# Altium project TeachEE.PrjPcb (part 1 of 2)
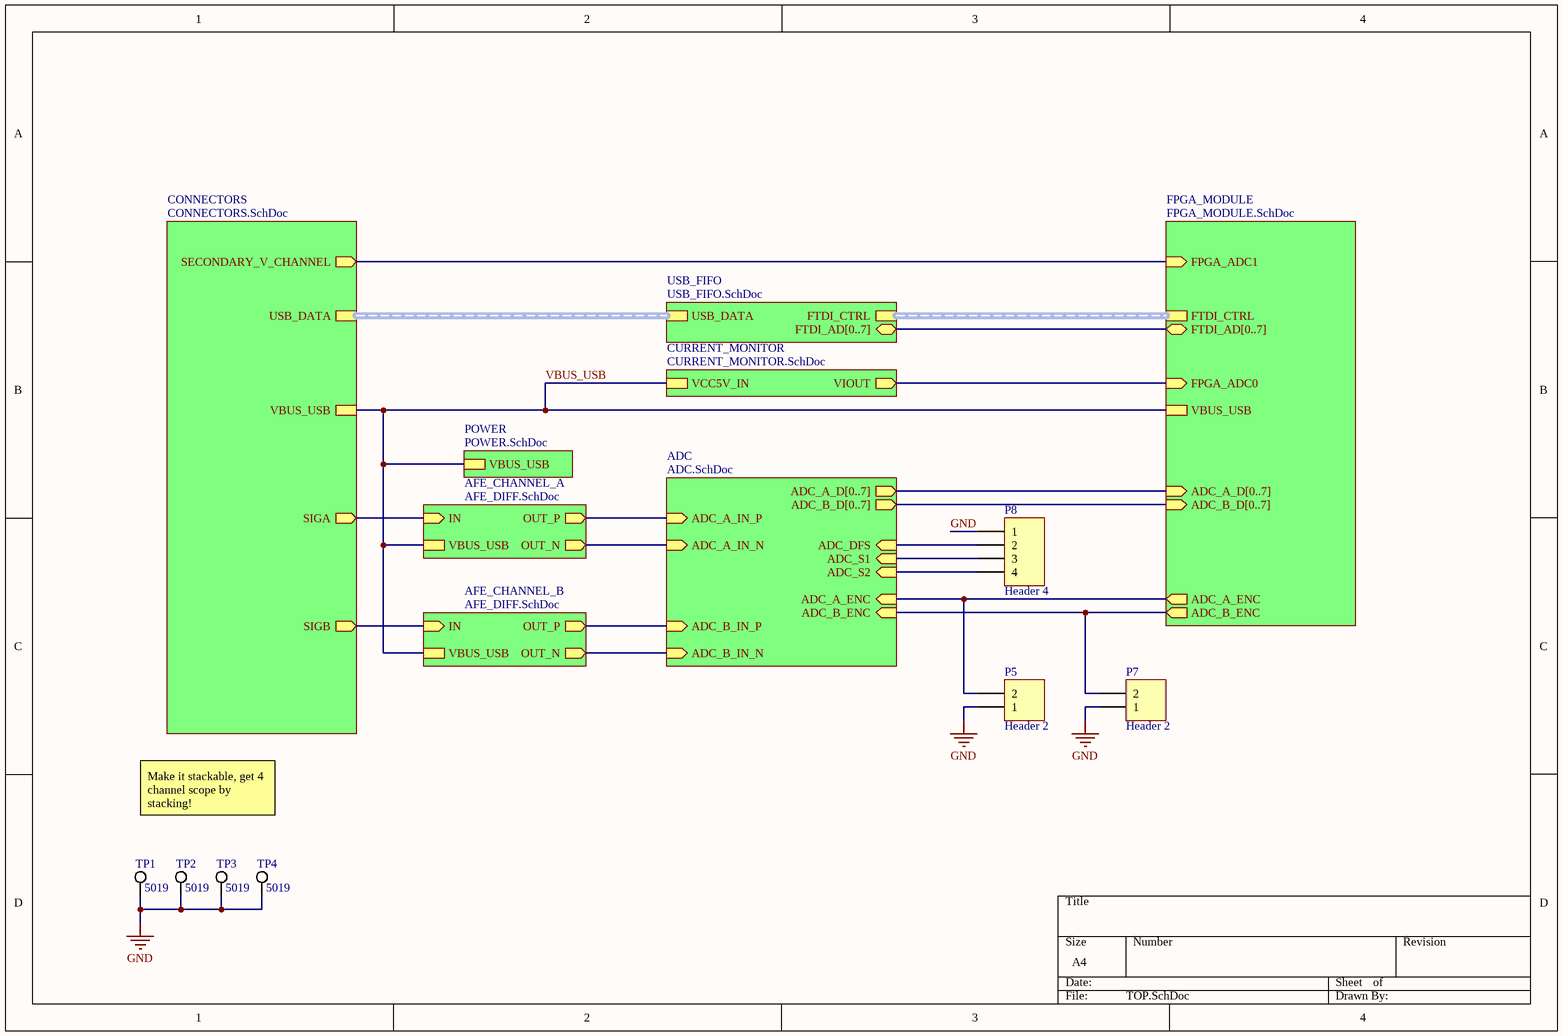
[diagram p0: TOP.SchDoc]
8 sheets, 192 parts. Net scope: hierarchical (ports join the sheet entries above them; power ports are global).
Board file: PCB.PcbDoc
Sheets:
  TOP.SchDoc
    USB_FIFO = USB_FIFO.SchDoc
    FPGA_MODULE = FPGA_MODULE.SchDoc
    CONNECTORS = CONNECTORS.SchDoc
    ADC = ADC.SchDoc
    POWER = POWER.SchDoc
    AFE_CHANNEL_A = AFE_DIFF.SchDoc
    CURRENT_MONITOR = CURRENT_MONITOR.SchDoc
    AFE_CHANNEL_B = AFE_DIFF.SchDoc

## Sheet TOP.SchDoc
size A4; SheetNumber: 1; SheetTotal: 9

### Parts
P5  Header 2  [HDR1X2]
P7  Header 2  [HDR1X2]
P8  Header 4  [HDR1X4]
TP1  5019  [KSTN-5019_V]
TP2  5019  [KSTN-5019_V]
TP3  5019  [KSTN-5019_V]
TP4  5019  [KSTN-5019_V]

### Sub-sheets
ADC = ADC.SchDoc: ADC_A_IN_P (in), ADC_A_D[0..7] (out), ADC_A_ENC (in), ADC_B_IN_P (in), ADC_B_ENC (in), ADC_DFS (in), ADC_S1 (in), ADC_S2 (in), ADC_B_D[0..7] (out), ADC_A_IN_N (in), ADC_B_IN_N (in)
AFE_CHANNEL_A = AFE_DIFF.SchDoc: IN (in), OUT_P (out), OUT_N (out), VBUS_USB
AFE_CHANNEL_B = AFE_DIFF.SchDoc: IN (in), OUT_P (out), OUT_N (out), VBUS_USB
CONNECTORS = CONNECTORS.SchDoc: USB_DATA (harness USB_DATA), VBUS_USB, SIGA (out), SECONDARY_V_CHANNEL (out), SIGB (out)
CURRENT_MONITOR = CURRENT_MONITOR.SchDoc: VIOUT (out), VCC5V_IN
FPGA_MODULE = FPGA_MODULE.SchDoc: FTDI_CTRL (harness FTDI_CTRL), FTDI_AD[0..7] (bidir), VBUS_USB, ADC_A_D[0..7] (in), ADC_A_ENC (out), FPGA_ADC0 (in), FPGA_ADC1 (in), ADC_B_ENC (out), ADC_B_D[0..7] (in)
POWER = POWER.SchDoc: VBUS_USB
USB_FIFO = USB_FIFO.SchDoc: USB_DATA (harness USB_DATA), FTDI_CTRL (harness FTDI_CTRL), FTDI_AD[0..7] (bidir)

### Nets
GND: P5.1 P7.1 P8.1 TP1.1 TP2.1 TP3.1 TP4.1
ADC_A_ENC: P5.2 ; sheet FPGA_MODULE/ADC_A_ENC, sheet ADC/ADC_A_ENC
ADC_A_IN_N: sheet ADC/ADC_A_IN_N, sheet AFE_CHANNEL_A/OUT_N
ADC_A_IN_P: sheet ADC/ADC_A_IN_P, sheet AFE_CHANNEL_A/OUT_P
ADC_B_ENC: P7.2 ; sheet FPGA_MODULE/ADC_B_ENC, sheet ADC/ADC_B_ENC
ADC_B_IN_N: sheet ADC/ADC_B_IN_N, sheet AFE_CHANNEL_B/OUT_N
ADC_B_IN_P: sheet ADC/ADC_B_IN_P, sheet AFE_CHANNEL_B/OUT_P
ADC_DFS: P8.2 ; sheet ADC/ADC_DFS
ADC_S1: P8.3 ; sheet ADC/ADC_S1
ADC_S2: P8.4 ; sheet ADC/ADC_S2
FPGA_ADC0: sheet FPGA_MODULE/FPGA_ADC0, sheet CURRENT_MONITOR/VIOUT
FPGA_ADC1: sheet FPGA_MODULE/FPGA_ADC1, sheet CONNECTORS/SECONDARY_V_CHANNEL
SIGA: sheet CONNECTORS/SIGA, sheet AFE_CHANNEL_A/IN
SIGB: sheet CONNECTORS/SIGB, sheet AFE_CHANNEL_B/IN
VBUS_USB: sheet FPGA_MODULE/VBUS_USB, sheet CONNECTORS/VBUS_USB, sheet POWER/VBUS_USB, sheet AFE_CHANNEL_A/VBUS_USB, sheet CURRENT_MONITOR/VCC5V_IN, sheet AFE_CHANNEL_B/VBUS_USB

### Buses and harness runs
bus sheet ADC/ADC_A_D[0..7] = sheet FPGA_MODULE/ADC_A_D[0..7]
bus sheet ADC/ADC_B_D[0..7] = sheet FPGA_MODULE/ADC_B_D[0..7]
bus sheet FPGA_MODULE/FTDI_AD[0..7] = sheet USB_FIFO/FTDI_AD[0..7]
harness sheet CONNECTORS/USB_DATA = sheet USB_FIFO/USB_DATA
harness sheet FPGA_MODULE/FTDI_CTRL = sheet USB_FIFO/FTDI_CTRL

### Notes on the sheet
- Make it stackable, get 4 channel scope by stacking!

### Library data of the parts
P5 P7 = Header 2: Header, 2-Pin; LatestRevisionDate: 17-Jul-2002; LatestRevisionNote: Re-released for DXP Platform.; Publisher: Altium Limited
P8 = Header 4: Header, 4-Pin; LatestRevisionDate: 17-Jul-2002; LatestRevisionNote: Re-released for DXP Platform.; Publisher: Altium Limited
TP1-TP4 = CMP-1672-00008-1: Test Point, 1 Position SMD, RoHS, Tape and Reel; ComponentLink1Description: Manufacturer URL; Package Quantity: 1000; DatasheetVersion: 03/2014; Packaging: Tape and Reel; ComponentLink2URL: http://www.keyelco.com/product-pdf.cfm?p=1357; ComponentLink1URL: http://www.keyelco.com/; Mount: Surface Mount; Contact Plating: Silver; PackageDescription: 1-Pin Surface Mount Device, Body 3.81 x 2.03 mm; Pins: 1; RoHSCompliant: True; Mounting Technology: Surface Mount; ComponentLink2Description: Datasheet; PackageReference: 5019

## Sheet USB_FIFO.SchDoc
size A4; SheetNumber: 3; SheetTotal: 8
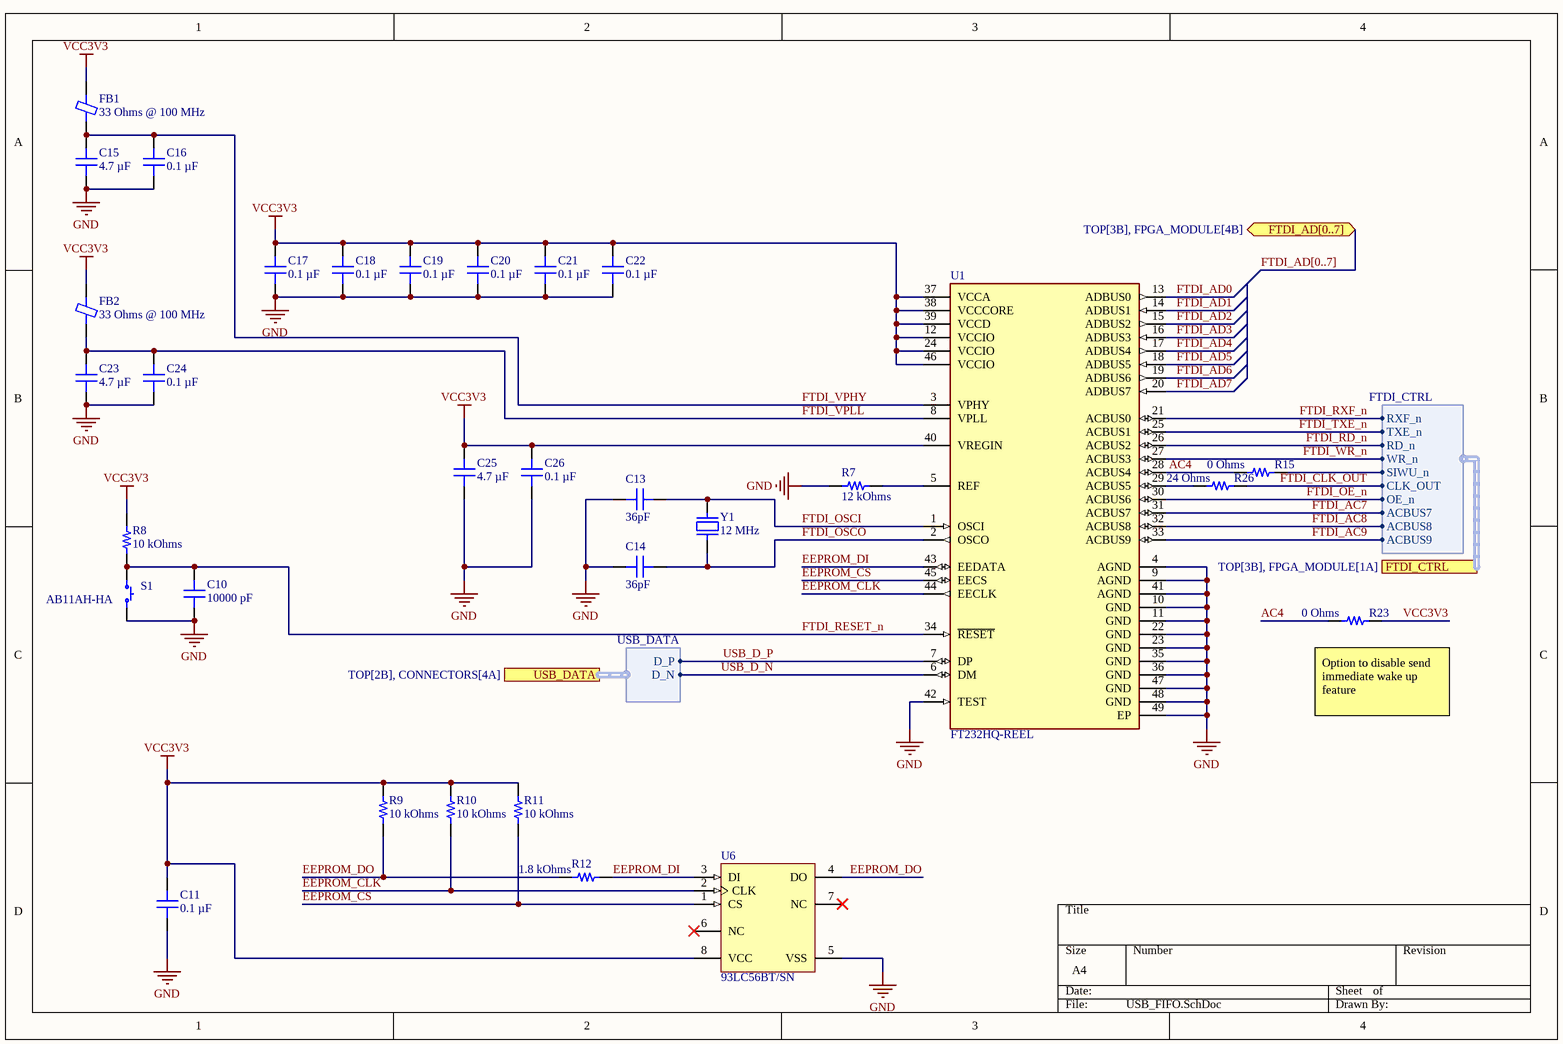
[diagram p1: USB_FIFO.SchDoc]

### Parts
C10  10000 pF  [CAP 0402_1005]
C11  0.1 µF  [CAP 0402_1005]
C13  36pF  [CAP 0603_1608]
C14  36pF  [CAP 0603_1608]
C15  4.7 µF  [CAP 0402_1005]
C16  0.1 µF  [CAP 0402_1005]
C17  0.1 µF  [CAP 0402_1005]
C18  0.1 µF  [CAP 0402_1005]
C19  0.1 µF  [CAP 0402_1005]
C20  0.1 µF  [CAP 0402_1005]
C21  0.1 µF  [CAP 0402_1005]
C22  0.1 µF  [CAP 0402_1005]
C23  4.7 µF  [CAP 0402_1005]
C24  0.1 µF  [CAP 0402_1005]
C25  4.7 µF  [CAP 0402_1005]
C26  0.1 µF  [CAP 0402_1005]
FB1  33 Ohms @ 100 MHz  [FER 0201_0603]
FB2  33 Ohms @ 100 MHz  [FER 0201_0603]
R7  12 kOhms  [RES 0402_1005]
R8  10 kOhms  [RES 0402_1005]
R9  10 kOhms  [RES 0402_1005]
R10  10 kOhms  [RES 0402_1005]
R11  10 kOhms  [RES 0402_1005]
R12  1.8 kOhms  [RES 0402_1005]
R15  0 Ohms  [RES 0603_1608]
R23  0 Ohms  [RES 0603_1608]
R26  24 Ohms  [RES 0402_1005]
S1  AB11AH-HA  [NKK AB11AH-HA]
U1  FT232HQ-REEL  [FP-QFN-48-MFG]
U6  93LC56BT/SN  [SOIC-SN8_M]
Y1  12 MHz  [ABRACON ABLS]

### Ports
FTDI_AD[0..7] (bidir, see TOP[3B], FPGA_MODULE[4B]), FTDI_CTRL (harness FTDI_CTRL, see TOP[3B], FPGA_MODULE[1A]), USB_DATA (harness USB_DATA, see TOP[2B], CONNECTORS[4A])

### Harnesses
USB_DATA: D_N, D_P
FTDI_CTRL: RXF_n, TXE_n, RD_n, WR_n, CLK_OUT, OE_n, ACBUS7, ACBUS8, ACBUS9, SIWU_n

### Nets
GND: C10.1 C11.1 C13.1 C14.1 C15.1 C16.1 C17.1 C18.1 C19.1 C20.1 C21.1 C22.1 C23.1 C24.1 C25.1 C26.1 R7.1 S1.1 U1.4(AGND) U1.9(AGND) U1.10(GND) U1.11(GND) U1.22(GND) U1.23(GND) U1.35(GND) U1.36(GND) U1.41(AGND) U1.42(TEST) U1.47(GND) U1.48(GND) U1.49(EP) U6.5(VSS)
VCC3V3: C11.2 C17.2 C18.2 C19.2 C20.2 C21.2 C22.2 C25.2 C26.2 FB1.2 FB2.2 R8.2 R9.2 R10.2 R11.2 R23.2 U1.12(VCCIO) U1.24(VCCIO) U1.37(VCCA) U1.38(VCCCORE) U1.39(VCCD) U1.40(VREGIN) U1.46(VCCIO) U6.8(VCC)
AC4: R15.1 R23.1 U1.28(ACBUS4)
EEPROM_CLK: R10.1 U1.44(EECLK) U6.2(CLK)
EEPROM_CS: R11.1 U1.45(EECS) U6.1(CS)
EEPROM_DI: R12.2 U1.43(EEDATA) U6.3(DI)
EEPROM_DO: R9.1 R12.1 U6.4(DO)
FTDI_AC7: U1.31(ACBUS7) ; port FTDI_CTRL.ACBUS7
FTDI_AC8: U1.32(ACBUS8) ; port FTDI_CTRL.ACBUS8
FTDI_AC9: U1.33(ACBUS9) ; port FTDI_CTRL.ACBUS9
FTDI_AD0: U1.13(ADBUS0)
FTDI_AD1: U1.14(ADBUS1)
FTDI_AD2: U1.15(ADBUS2)
FTDI_AD3: U1.16(ADBUS3)
FTDI_AD4: U1.17(ADBUS4)
FTDI_AD5: U1.18(ADBUS5)
FTDI_AD6: U1.19(ADBUS6)
FTDI_AD7: U1.20(ADBUS7)
FTDI_CLK_OUT: R26.2 ; port FTDI_CTRL.CLK_OUT
FTDI_OE_n: U1.30(ACBUS6) ; port FTDI_CTRL.OE_n
FTDI_OSCI: C13.2 U1.1(OSCI) Y1.2
FTDI_OSCO: C14.2 U1.2(OSCO) Y1.1
FTDI_RD_n: U1.26(ACBUS2) ; port FTDI_CTRL.RD_n
FTDI_RESET_n: C10.2 R8.1 S1.3 U1.34(~{RESET})
FTDI_RXF_n: U1.21(ACBUS0) ; port FTDI_CTRL.RXF_n
FTDI_TXE_n: U1.25(ACBUS1) ; port FTDI_CTRL.TXE_n
FTDI_VPHY: C15.2 C16.2 FB1.1 U1.3(VPHY)
FTDI_VPLL: C23.2 C24.2 FB2.1 U1.8(VPLL)
FTDI_WR_n: U1.27(ACBUS3) ; port FTDI_CTRL.WR_n
SIWU_n: R15.2 ; port FTDI_CTRL.SIWU_n
USB_D_N: U1.6(DM) ; port USB_DATA.D_N
USB_D_P: U1.7(DP) ; port USB_DATA.D_P
NetR7_2: R7.2 U1.5(REF)
NetR26_1: R26.1 U1.29(ACBUS5)

Not connected (* = marked no-connect by the designer): U6 6(NC)* 7(NC)*

### Buses and harness runs
bus FTDI_AD[0..7] = port FTDI_AD[0..7]

### Notes on the sheet
- (near R23) Option to disable send immediate wake up feature

### Library data of the parts
C10 = HMK105B7103KVHFE: CAP MLCC 0.01UF 100V X7R 0402; manufacturer: Taiyo Yuden; Tolerance: ±10%; Part Number: HMK105B7103KVHFE; Value: 10000 pF; Applications: Automotive, SMPS Filtering; Capacitance: 10000 pF; componentlink1description: Datasheet; componentlink1url: https://ds.yuden.co.jp/TYCOMPAS/ut/detail?pn=HMK105B7103KVHFE&u=M; componentlink2description: DigiKey Link; componentlink2url: https://www.digikey.com/en/products/detail/taiyo-yuden/HMK105B7103KVHFE/11687483; Device Package: 0402 (1005 Metric); lastupdated: 2022-07-15 11:24:57 AM; Lifecycle Status: Active; Minimum Order: 1; Mounting Type: Surface Mount, MLCC; Operating Temperature: -55°C ~ 125°C; Package / Case: 0402 (1005 Metric); packaging: TapeAndReel; partid: 41784; Part Status: Active; price: 0.02; Ratings: AEC-Q200; series: M; Size / Dimension: 0.039" L x 0.020" W (1.00mm x 0.50mm); Supplier 1: DigiKey; Supplier Part Number 1: 587-HMK105B7103KVHFECT-ND; Temperature Coefficient: X7R; Thickness (Max): 0.022" (0.55mm); Voltage - Rated: 100V
C11 C16-C22 C24 C26 = CGA2B3X5R1H104M050BB: CAP CER 0.1UF 50V X5R 0402; manufacturer: TDK Corporation; Tolerance: ±20%; Part Number: CGA2B3X5R1H104M050BB; Value: 0.1 µF; Applications: Automotive; Capacitance: 0.1 µF; componentlink1description: Datasheet; componentlink1url: https://product.tdk.com/info/en/catalog/datasheets/mlcc_automotive_general_en.pdf?ref_disty=digikey; componentlink2description: DigiKey Link; componentlink2url: https://www.digikey.com/en/products/detail/tdk-corporation/CGA2B3X5R1H104M050BB/3949450; Device Package: 0402 (1005 Metric); Lifecycle Status: Active; Minimum Order: 1; Mounting Type: Surface Mount, MLCC; Operating Temperature: -55°C ~ 85°C; Package / Case: 0402 (1005 Metric); packaging: TapeAndReel; partid: 1792; Part Status: Active; price: 0.02; Ratings: AEC-Q200; series: CGA; Size / Dimension: 0.039" L x 0.020" W (1.00mm x 0.50mm); Supplier 1: DigiKey; Supplier Part Number 1: 445-12214-1-ND; Temperature Coefficient: X5R; Thickness (Max): 0.022" (0.55mm); Voltage - Rated: 50V
  C11: lastupdated: 2022-07-15 11:25:55 AM
  C16-C22 C24 C26: lastupdated: 2022-07-21 3:55:54 AM
C13 C14 = 06031A360JAT2A: CAP CER 36PF 100V NP0 0603; manufacturer: AVX Corporation; Temperature Coefficient: C0G, NP0; Tolerance: ±5%; Part Number: 06031A360JAT2A; Value: 36pF; Applications: General Purpose; Capacitance: 36pF; componentlink1description: Datasheet; componentlink1url: http://datasheets.avx.com/C0GNP0-Dielectric.pdf; componentlink2description: DigiKey Link; componentlink2url: http://digikey.com/product-detail/en/avx-corporation/06031A360JAT2A/478-10202-1-ND/6797206; Device Package: 0603 (1608 Metric); lastupdated: 2020-09-02 1:03:27 AM; Lifecycle Status: Active; Minimum Order: 1; Mounting Type: Surface Mount, MLCC; Operating Temperature: -55°C ~ 125°C; Package / Case: 0603 (1608 Metric); packaging: TapeAndReel; partid: 7331; Part Status: Active; price: 0.04; series: -; Size / Dimension: 0.063" L x 0.032" W (1.60mm x 0.81mm); Supplier 1: DigiKey; Supplier Part Number 1: 478-10202-1-ND; Thickness (Max): 0.035" (0.90mm); Voltage - Rated: 100V
C15 C23 C25 = CL05A475MO5NUNC: CAP CER 4.7UF 16V X5R 0402; manufacturer: Samsung Electro-Mechanics; Tolerance: ±20%; Part Number: CL05A475MO5NUNC; Value: 4.7 µF; Applications: General Purpose; Capacitance: 4.7 µF; componentlink1description: Datasheet; componentlink1url: http://www.samsungsem.com/kr/support/product-search/mlcc/__icsFiles/afieldfile/2019/05/29/Data%20sheet_CL05A475MO5NUNC.pdf; componentlink2description: DigiKey Link; componentlink2url: https://www.digikey.com/en/products/detail/samsung-electro-mechanics/CL05A475MO5NUNC/5961320; Device Package: 0402 (1005 Metric); lastupdated: 2022-07-21 3:55:55 AM; Lifecycle Status: Active; Minimum Order: 1; Mounting Type: Surface Mount, MLCC; Operating Temperature: -55°C ~ 85°C; Package / Case: 0402 (1005 Metric); packaging: TapeAndReel; partid: 1760; Part Status: Active; price: 0.09; series: CL; Size / Dimension: 0.039" L x 0.020" W (1.00mm x 0.50mm); Supplier 1: DigiKey; Supplier Part Number 1: 1276-6836-1-ND; Temperature Coefficient: X5R; Thickness (Max): 0.028" (0.70mm); Voltage - Rated: 16V
FB1 FB2 = MMZ0603F330CT000: FERRITE BEAD 33 OHM 0201 1LN; Manufacturer: TDK Corporation; Current Rating (Max): 150mA; DC Resistance (DCR) (Max): 1.3Ohm; Filter Type: Signal Line; Number of Lines: 1; Part Number: MMZ0603F330CT000; ComponentLink1Description: Datasheet; ComponentLink1URL: https://product.tdk.com/info/en/catalog/datasheets/beads_commercial_signal_mmz0603_en.pdf?ref_disty=digikey; ComponentLink2Description: DigiKey Link; ComponentLink2URL: https://www.digikey.com/en/products/detail/tdk-corporation/MMZ0603F330CT000/2747662; Device Package: 0201 (0603 Metric); Height (Max): 0.013" (0.33mm); Impedance @ Frequency: 33 Ohms @ 100 MHz; LastUpdated: 2022-07-21 4:37:41 AM; Lifecycle Status: Active; Minimum Order: 1; Mounting Type: Surface Mount; Operating Temperature: -55°C ~ 125°C; Package / Case: 0201 (0603 Metric); Packaging: TapeAndReel; PartId: 1; Part Status: Active; Price: 0.03; Series: MMZ; Size / Dimension: 0.024" L x 0.012" W (0.60mm x 0.30mm); Supplier 1: DigiKey; Supplier Part Number 1: 445-7792-1-ND; Value: 33 Ohms @ 100 MHz
R7 = CPF0402B12KE1: RES SMD 12K OHM 0.1% 1/16W 0402; Manufacturer: TE Connectivity Passive Product; Power (Watts): 0.063W, 1/16W; Temperature Coefficient: ±25ppm/°C; Part Number: CPF0402B12KE1; Value: 12 kOhms; ComponentLink1Description: Datasheet; ComponentLink1URL: https://www.te.com/commerce/DocumentDelivery/DDEController?Action=srchrtrv&DocNm=1773200&DocType=DS&DocLang=English; ComponentLink2Description: DigiKey Link; ComponentLink2URL: https://www.digikey.com/en/products/detail/te-connectivity-passive-product/CPF0402B12KE1/2381830; Composition: Thin Film; Device Package: 0402 (1005 Metric); Height - Seated (Max): 0.014" (0.35mm); LastUpdated: 2022-07-15 11:43:11 AM; Lifecycle Status: Active; Minimum Order: 1; Number of Terminations: 2; Operating Temperature: -55°C ~ 155°C; Package / Case: 0402 (1005 Metric); Packaging: TapeAndReel; PartId: 3318; Part Status: Active; Price: 0.15; Resistance: 12 kOhms; Series: CPF, Neohm; Size / Dimension: 0.039" L x 0.020" W (1.00mm x 0.50mm); Supplier 1: DigiKey; Supplier Part Number 1: A102603CT-ND; Supplier Device Package: 0402; Tolerance: ±0.1%
R8-R11 = RP73PF1E10KBTD: RES 10K OHM 0.1% 1/10W 0402; Manufacturer: TE Connectivity Passive Product; Power (Watts): 0.1W, 1/10W; Temperature Coefficient: ±25ppm/°C; Part Number: RP73PF1E10KBTD; Value: 10 kOhms; ComponentLink1Description: Datasheet; ComponentLink1URL: https://www.te.com/commerce/DocumentDelivery/DDEController?Action=srchrtrv&DocNm=1773272&DocType=DS&DocLang=English; ComponentLink2Description: DigiKey Link; ComponentLink2URL: https://www.digikey.com/en/products/detail/te-connectivity-passive-product/RP73PF1E10KBTD/8260957; Composition: Thin Film; Device Package: 0402 (1005 Metric); Height - Seated (Max): 0.014" (0.35mm); LastUpdated: 2022-07-15 11:43:14 AM; Lifecycle Status: Active; Minimum Order: 1; Number of Terminations: 2; Operating Temperature: -55°C ~ 155°C; Package / Case: 0402 (1005 Metric); Packaging: TapeAndReel; PartId: 2434; Part Status: Active; Price: 0.09; Resistance: 10 kOhms; Series: RP73, Holsworthy; Size / Dimension: 0.039" L x 0.020" W (1.00mm x 0.50mm); Supplier 1: DigiKey; Supplier Part Number 1: A127415CT-ND; Supplier Device Package: 0402; Tolerance: ±0.1%
R12 = RC0402FR-071K8L: RES 1.8K OHM 1% 1/16W 0402; Manufacturer: Yageo; Power (Watts): 0.063W, 1/16W; Temperature Coefficient: ±100ppm/°C; Part Number: RC0402FR-071K8L; Value: 1.8 kOhms; ComponentLink1Description: Datasheet; ComponentLink1URL: https://www.yageo.com/upload/media/product/productsearch/datasheet/rchip/PYu-RC_Group_51_RoHS_L_10.pdf; ComponentLink2Description: DigiKey Link; ComponentLink2URL: https://www.digikey.com/en/products/detail/yageo/RC0402FR-071K8L/726520; Composition: Thick Film; Device Package: 0402 (1005 Metric); Features: Moisture Resistant; Height - Seated (Max): 0.016" (0.40mm); LastUpdated: 2022-07-21 4:11:16 AM; Lifecycle Status: Active; Minimum Order: 1; Number of Terminations: 2; Operating Temperature: -55°C ~ 155°C; Package / Case: 0402 (1005 Metric); Packaging: CutTape; PartId: 2542; Part Status: Active; Price: 0.01; Resistance: 1.8 kOhms; Series: RC_L; Size / Dimension: 0.039" L x 0.020" W (1.00mm x 0.50mm); Supplier 1: DigiKey; Supplier Part Number 1: 311-1.80KLRCT-ND; Supplier Device Package: 0402; Tolerance: ±1%
R15 R23 = 5110: RES SMD 0 OHM JUMPER 1/2W 0603; Part Number: 5110; Manufacturer: Keystone Electronics; Power (Watts): 0.5W, 1/2W; Value: 0 Ohms; ComponentLink1Description: Datasheet; ComponentLink1URL: http://keyelco.com/userAssets/file/M65p54.pdf; ComponentLink2Description: DigiKey Link; ComponentLink2URL: https://www.digikey.com/en/products/detail/keystone-electronics/5110/5118870; Composition: Metal Element; Device Package: 0603 (1608 Metric); Height - Seated (Max): 0.028" (0.70mm); LastUpdated: 2022-09-14 8:08:57 AM; Lifecycle Status: Active; Minimum Order: 1; Number of Terminations: 2; Package / Case: 0603 (1608 Metric); Packaging: TapeAndReel; PartId: 20779; Part Status: Active; Price: 0.16; Resistance: 0 Ohms; Series: -; Size / Dimension: 0.061" L x 0.033" W (1.55mm x 0.85mm); Supplier 1: DigiKey; Supplier Part Number 1: 36-5110CT-ND; Supplier Device Package: 0603; Tolerance: Jumper
R26 = RC0402FR-0724RL: RES 24 OHM 1% 1/16W 0402; Manufacturer: Yageo; Power (Watts): 0.063W, 1/16W; Temperature Coefficient: ±100ppm/°C; Part Number: RC0402FR-0724RL; Value: 24 Ohms; ComponentLink1Description: Datasheet; ComponentLink1URL: https://www.yageo.com/upload/media/product/productsearch/datasheet/rchip/PYu-RC_Group_51_RoHS_L_10.pdf; ComponentLink2Description: DigiKey Link; ComponentLink2URL: https://www.digikey.com/en/products/detail/yageo/RC0402FR-0724RL/5280933; Composition: Thick Film; Device Package: 0402 (1005 Metric); Features: Moisture Resistant; Height - Seated (Max): 0.016" (0.40mm); LastUpdated: 2022-09-19 1:15:03 PM; Lifecycle Status: Active; Minimum Order: 1; Number of Terminations: 2; Operating Temperature: -55°C ~ 155°C; Package / Case: 0402 (1005 Metric); Packaging: CutTape; PartId: 2811; Part Status: Active; Price: 0.01; Resistance: 24 Ohms; Series: RC_L; Size / Dimension: 0.039" L x 0.020" W (1.00mm x 0.50mm); Supplier 1: DigiKey; Supplier Part Number 1: YAG3073CT-ND; Supplier Device Package: 0402; Tolerance: ±1%
S1 = AB11AH-HA: SWITCH PUSH SPST-NO 0.4VA 28V; Manufacturer: NKK Switches; Actuator Type: Round, Button; Color - Actuator/Cap: Black; Current Rating (Amps): 0.4VA (AC/DC); Switch Function: Off-Mom; Part Number: AB11AH-HA; Circuit: SPST-NO; ComponentLink1Description: Datasheet; ComponentLink1URL: https://www.nkkswitches.com/pdf/Apushbuttons.pdf; ComponentLink2Description: DigiKey Link; ComponentLink2URL: //digikey.com/product-detail/en/nkk-switches/AB11AH-HA/360-2703-ND/1056050; Features: Sealed - Fully; LastUpdated: 2019-12-12 8:13:11 AM; Lifecycle Status: 0; Minimum Order: 1; Mounting Type: Through Hole, Right Angle; Operating Temperature: -30°C ~ 85°C; Packaging: Tray; Part Status: Active; Price: 5.00; Series: AB; Supplier 1: DigiKey; Supplier Part Number 1: 360-2703-ND; Termination Style: PC Pin; Type: Standard; Voltage Rating - AC: 28V; Voltage Rating - DC: 28V
U1 = CMP-0078-00034-4: IC HS USB TO UART/FIFO 48QFN; Number of Channels: 1; Max Supply Voltage: 3.63V; Min Supply Voltage: 2.97V; Operating Supply Current: 24mA; Data Rate: 12Mbps; Interface: UART; Nominal Supply Current: 60mA; Operating Supply Voltage: 3.3V; Case/Package: QFN; Packaging: Tape and Reel; Weight: 0.005309oz; Number of Pins: 48; REACH SVHC: No SVHC; Length: 7mm; Mount: Surface Mount; Package Quantity: 1; Lead Free: Lead Free; Radiation Hardening: No; Max Operating Temperature: 85°C; Min Operating Temperature: -40°C; Height: 1.4mm; Width: 7mm
U6 = CMP-0162-00132-1: 2K, 128x16-bit, 2.5V Microwire Serial EEPROM, 8-Pin SOIC 150mil, Commercial Temperature, Tape and Reel; ComponentAvailability: Unknown. Contact manufacturer to determine status.; Code_IPC: SOIC127P600-8; PackageReference: SOIC-SN8; Code_JEDEC: MS-012; DatasheetVersion: revF, May-2008; PackageDescription: 8-Lead Plastic Small Outline (SN) - Narrow, 3.90mm Body [SOIC]; PackageVersion: revBB, Aug-2009
Y1 = ABLS-12.000MHZ-20-B-3-H-T: CRYSTAL 12.0000MHZ 20PF SMD; Manufacturer: Abracon LLC; ESR (Equivalent Series Resistance): 50 Ohms; Frequency Stability: ±35ppm; Frequency Tolerance: ±25ppm; Operating Mode: Fundamental; Part Number: ABLS-12.000MHZ-20-B-3-H-T; ComponentLink1Description: Datasheet; ComponentLink1URL: https://abracon.com/Resonators/abls.pdf; ComponentLink2Description: DigiKey Link; ComponentLink2URL: https://www.digikey.com/en/products/detail/abracon-llc/ABLS-12-000MHZ-20-B-3-H-T/9997914; Frequency: 12 MHz; Height - Seated (Max): 0.165" (4.20mm); LastUpdated: 2022-07-21 4:44:16 AM; Lifecycle Status: Active; Load Capacitance: 20pF; Minimum Order: 1; Mounting Type: Surface Mount; Operating Temperature: -20°C ~ 70°C; Package / Case: HC-49/US; Packaging: TapeAndReel; PartId: 124; Part Status: Active; Price: 0.09; Series: ABLS; Size / Dimension: 0.449" L x 0.185" W (11.40mm x 4.70mm); Supplier 1: DigiKey; Supplier Part Number 1: 535-15006-1-ND; Type: MHz Crystal; Value: 12 MHz

## Sheet FPGA_MODULE.SchDoc
size A4; SheetNumber: 5; SheetTotal: 8
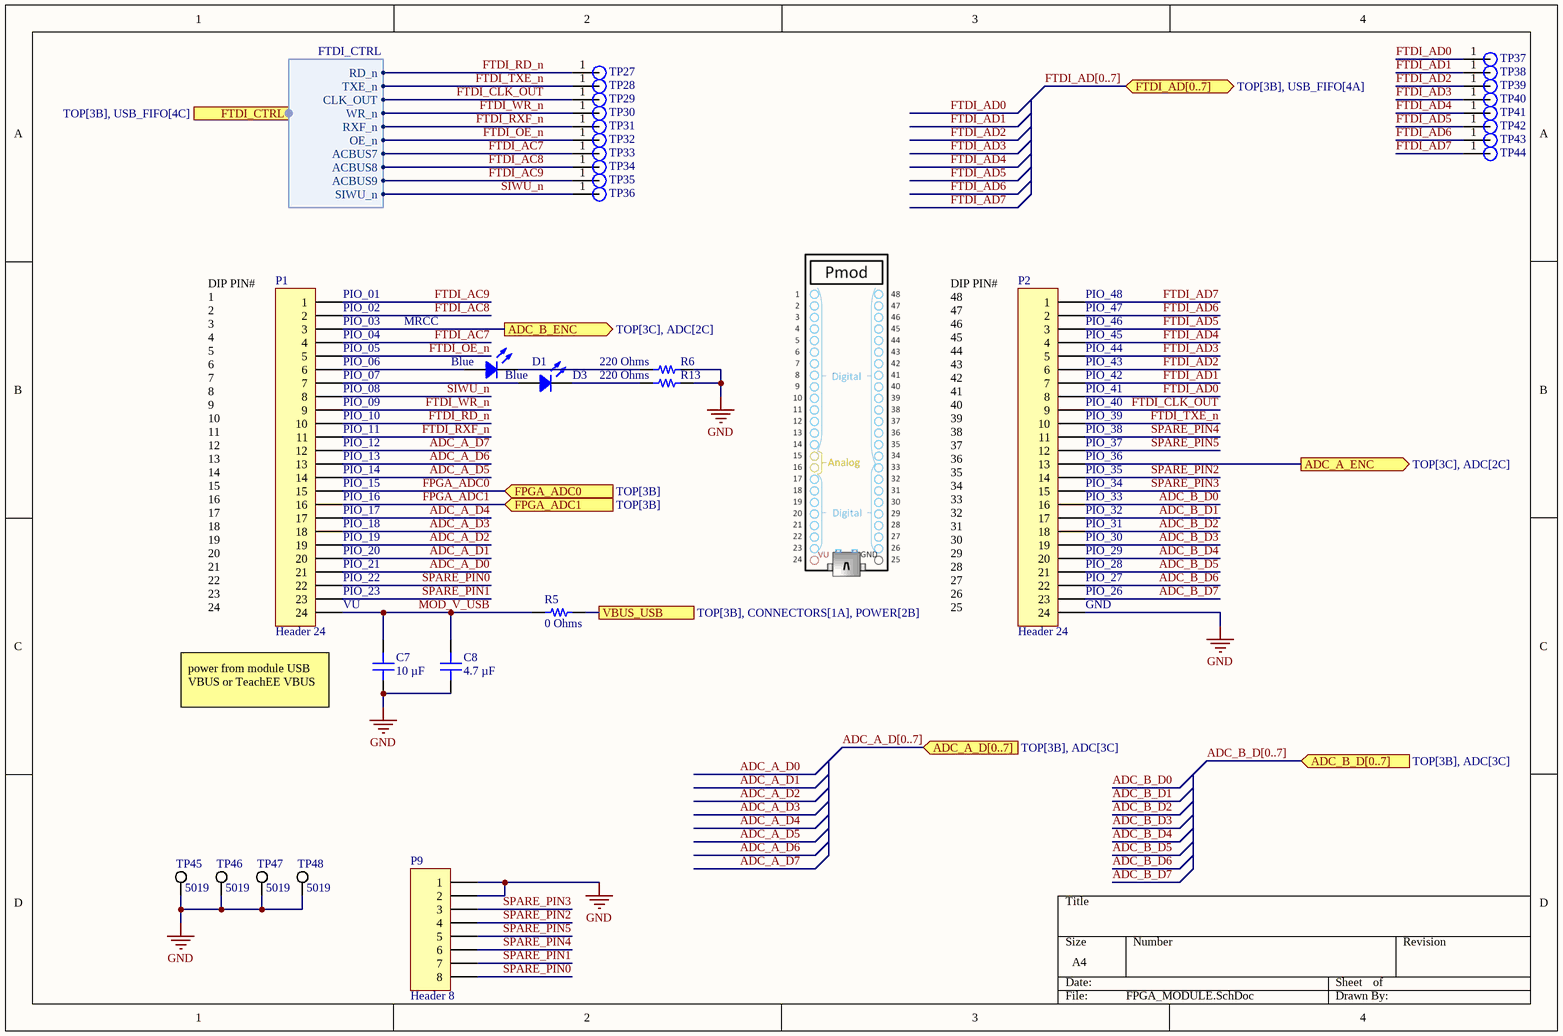
[diagram p2: FPGA_MODULE.SchDoc]

### Parts
C7  10 µF  [CAP 0805_2012]
C8  4.7 µF  [CAP 0402_1005]
D1  Blue  [LED 1206_3216 BLUE]
D3  Blue  [LED 1206_3216 BLUE]
P1  Header 24  [HDR1X24]
P2  Header 24  [HDR1X24]
P9  Header 8  [HDR1X8]
R5  0 Ohms  [RES 1206_3216]
R6  220 Ohms  [RES 0402_1005]
R13  220 Ohms  [RES 0402_1005]
TP27  Test Point  [TP1]  (value not drawn)  (no BOM)
TP28  Test Point  [TP1]  (value not drawn)  (no BOM)
TP29  Test Point  [TP1]  (value not drawn)  (no BOM)
TP30  Test Point  [TP1]  (value not drawn)  (no BOM)
TP31  Test Point  [TP1]  (value not drawn)  (no BOM)
TP32  Test Point  [TP1]  (value not drawn)  (no BOM)
TP33  Test Point  [TP1]  (value not drawn)  (no BOM)
TP34  Test Point  [TP1]  (value not drawn)  (no BOM)
TP35  Test Point  [TP1]  (value not drawn)  (no BOM)
TP36  Test Point  [TP1]  (value not drawn)  (no BOM)
TP37  Test Point  [TP1]  (value not drawn)  (no BOM)
TP38  Test Point  [TP1]  (value not drawn)  (no BOM)
TP39  Test Point  [TP1]  (value not drawn)  (no BOM)
TP40  Test Point  [TP1]  (value not drawn)  (no BOM)
TP41  Test Point  [TP1]  (value not drawn)  (no BOM)
TP42  Test Point  [TP1]  (value not drawn)  (no BOM)
TP43  Test Point  [TP1]  (value not drawn)  (no BOM)
TP44  Test Point  [TP1]  (value not drawn)  (no BOM)
TP45  5019  [KSTN-5019_V]
TP46  5019  [KSTN-5019_V]
TP47  5019  [KSTN-5019_V]
TP48  5019  [KSTN-5019_V]

### Ports
ADC_A_D[0..7] (in, see TOP[3B], ADC[3C]), ADC_A_ENC (out, see TOP[3C], ADC[2C]), ADC_B_D[0..7] (in, see TOP[3B], ADC[3C]), ADC_B_ENC (out, see TOP[3C], ADC[2C]), FPGA_ADC0 (in, see TOP[3B]), FPGA_ADC1 (in, see TOP[3B]), FTDI_AD[0..7] (bidir, see TOP[3B], USB_FIFO[4A]), FTDI_CTRL (harness FTDI_CTRL, see TOP[3B], USB_FIFO[4C]), VBUS_USB (see TOP[3B], CONNECTORS[1A], POWER[2B])

### Harnesses
FTDI_CTRL: RXF_n, TXE_n, RD_n, WR_n, CLK_OUT, OE_n, ACBUS7, ACBUS8, ACBUS9, SIWU_n

### Nets
GND: C7.1 C8.1 P2.24 P9.1 P9.2 R6.1 R13.1 TP45.1 TP46.1 TP47.1 TP48.1
ADC_A_D0: P1.21
ADC_A_D1: P1.20
ADC_A_D2: P1.19
ADC_A_D3: P1.18
ADC_A_D4: P1.17
ADC_A_D5: P1.14
ADC_A_D6: P1.13
ADC_A_D7: P1.12
ADC_A_ENC: P2.13 ; port ADC_A_ENC
ADC_B_D0: P2.16
ADC_B_D1: P2.17
ADC_B_D2: P2.18
ADC_B_D3: P2.19
ADC_B_D4: P2.20
ADC_B_D5: P2.21
ADC_B_D6: P2.22
ADC_B_D7: P2.23
ADC_B_ENC: P1.3 ; port ADC_B_ENC
FPGA_ADC0: P1.15 ; port FPGA_ADC0
FPGA_ADC1: P1.16 ; port FPGA_ADC1
FTDI_AC7: P1.4 TP33.1 ; port FTDI_CTRL.ACBUS7
FTDI_AC8: P1.2 TP34.1 ; port FTDI_CTRL.ACBUS8
FTDI_AC9: P1.1 TP35.1 ; port FTDI_CTRL.ACBUS9
FTDI_AD0: P2.8 TP37.1
FTDI_AD1: P2.7 TP38.1
FTDI_AD2: P2.6 TP39.1
FTDI_AD3: P2.5 TP40.1
FTDI_AD4: P2.4 TP41.1
FTDI_AD5: P2.3 TP42.1
FTDI_AD6: P2.2 TP43.1
FTDI_AD7: P2.1 TP44.1
FTDI_CLK_OUT: P2.9 TP29.1 ; port FTDI_CTRL.CLK_OUT
FTDI_OE_n: P1.5 TP32.1 ; port FTDI_CTRL.OE_n
FTDI_RD_n: P1.10 TP27.1 ; port FTDI_CTRL.RD_n
FTDI_RXF_n: P1.11 TP31.1 ; port FTDI_CTRL.RXF_n
FTDI_TXE_n: P2.10 TP28.1 ; port FTDI_CTRL.TXE_n
FTDI_WR_n: P1.9 TP30.1 ; port FTDI_CTRL.WR_n
MOD_V_USB: C7.2 C8.2 P1.24 R5.2
SIWU_n: P1.8 TP36.1 ; port FTDI_CTRL.SIWU_n
SPARE_PIN0: P1.22 P9.8
SPARE_PIN1: P1.23 P9.7
SPARE_PIN2: P2.14 P9.4
SPARE_PIN3: P2.15 P9.3
SPARE_PIN4: P2.11 P9.6
SPARE_PIN5: P2.12 P9.5
VBUS_USB: R5.1 ; port VBUS_USB
NetD1_1: D1.1 P1.6
NetD1_2: D1.2 R6.2
NetD3_1: D3.1 P1.7
NetD3_2: D3.2 R13.2

### Buses and harness runs
bus ADC_A_D[0..7] = port ADC_A_D[0..7]
bus ADC_B_D[0..7] = port ADC_B_D[0..7]
bus FTDI_AD[0..7] = port FTDI_AD[0..7]

### Notes on the sheet
- (near P1) PIO_01
- (near P1) PIO_02
- (near P2) PIO_47
- (near P2) PIO_48
- (near P1) PIO_03        MRCC
- (near P1) PIO_04
- (near P1) PIO_05
- (near P1) PIO_06
- (near P1) PIO_07
- (near P2) PIO_42
- (near P2) PIO_43
- (near P2) PIO_44
- (near P2) PIO_45
- (near P2) PIO_46
- (near P1) PIO_08
- (near P1) PIO_09
- (near P1) PIO_10
- (near P1) PIO_11
- (near P1) PIO_12
- (near P2) PIO_37
- (near P2) PIO_38
- (near P2) PIO_39
- (near P2) PIO_40
- (near P2) PIO_41
- (near P1) PIO_13
- (near P1) PIO_14
- (near P1) PIO_15
- (near P1) PIO_16
- (near P1) PIO_17
- (near P2) PIO_32
- (near P2) PIO_33
- (near P2) PIO_34
- (near P2) PIO_35
- (near P2) PIO_36
- (near P1) PIO_18
- (near P1) PIO_19
- (near P1) PIO_20
- (near P1) PIO_21
- (near P1) PIO_22
- (near P2) PIO_27
- (near P2) PIO_28
- (near P2) PIO_29
- (near P2) PIO_30
- (near P2) PIO_31
- DIP PIN#
  1
  2
  3
  4
  5
  6
  7
  8
  9
  10
  11
  12
  13
  14
  15
  16
  17
  18
  19
  20
  21
  22
  23
  24
- (near P1) PIO_23
- (near P1) VU
- DIP PIN#
  48
  47
  46
  45
  44
  43
  42
  41
  40
  39
  38
  37
  36
  35
  34
  33
  32
  31
  30
  29
  28
  27
  26
  25
- (near P2) PIO_26
- (near P2) GND
- power from module USB VBUS or TeachEE VBUS

### Library data of the parts
C7 = GRM21BC8YA106KE11L: CAP CER 10UF 35V X6S 0805; manufacturer: Murata Electronics; Tolerance: ±10%; Part Number: GRM21BC8YA106KE11L; Value: 10 µF; Applications: General Purpose; Capacitance: 10 µF; componentlink1description: Datasheet; componentlink1url: https://search.murata.co.jp/Ceramy/image/img/A01X/G101/ENG/GRM21BC8YA106KE11-01.pdf; componentlink2description: DigiKey Link; componentlink2url: https://www.digikey.com/en/products/detail/murata-electronics/GRM21BC8YA106KE11L/5027589; Device Package: 0805 (2012 Metric); lastupdated: 2022-07-21 4:01:21 AM; Lifecycle Status: Active; Minimum Order: 1; Mounting Type: Surface Mount, MLCC; Operating Temperature: -55°C ~ 105°C; Package / Case: 0805 (2012 Metric); packaging: TapeAndReel; partid: 16091; Part Status: Active; price: 0.11; series: GRM; Size / Dimension: 0.079" L x 0.049" W (2.00mm x 1.25mm); Supplier 1: DigiKey; Supplier Part Number 1: 490-10504-1-ND; Temperature Coefficient: X6S; Thickness (Max): 0.057" (1.45mm); Voltage - Rated: 35V
C8 = CL05A475MO5NUNC: as C15 on sheet USB_FIFO; Part Number: CL05A475MO5NUNC; Value: 4.7 µF; Applications: General Purpose; Capacitance: 4.7 µF; componentlink1description: Datasheet; componentlink1url: http://www.samsungsem.com/kr/support/product-search/mlcc/__icsFiles/afieldfile/2019/05/29/Data%20sheet_CL05A475MO5NUNC.pdf; componentlink2description: DigiKey Link; componentlink2url: https://www.digikey.com/en/products/detail/samsung-electro-mechanics/CL05A475MO5NUNC/5961320; Device Package: 0402 (1005 Metric); lastupdated: 2022-07-21 3:55:55 AM; Lifecycle Status: Active; Minimum Order: 1; Mounting Type: Surface Mount, MLCC; Operating Temperature: -55°C ~ 85°C; Package / Case: 0402 (1005 Metric); packaging: TapeAndReel; partid: 1760; Part Status: Active; price: 0.09; series: CL; Size / Dimension: 0.039" L x 0.020" W (1.00mm x 0.50mm); Supplier 1: DigiKey; Supplier Part Number 1: 1276-6836-1-ND; Temperature Coefficient: X5R; Thickness (Max): 0.028" (0.70mm); Voltage - Rated: 16V
D1 D3 = APTL3216QBC/D-01: LED SMD; Manufacturer: Kingbright; Configuration: 1206; Current - Test: 20mA; Lens Color: Colorless; Lens Size: 1.10mm Dia; Lens Style: Round with Domed Top; Lens Transparency: Clear; Millicandela Rating: 250mcd; Viewing Angle: 80°; Voltage - Forward (Vf) (Typ): 3.3V; Wavelength - Dominant: 465nm; Wavelength - Peak: 460nm; Part Number: APTL3216QBC/D-01; Color: Blue; ComponentLink1Description: Datasheet; ComponentLink1URL: http://www.kingbrightusa.com/images/catalog/SPEC/APTL3216QBC-D-01.pdf; ComponentLink2Description: DigiKey Link; ComponentLink2URL: https://www.digikey.com/en/products/detail/kingbright/APTL3216QBC-D-01/10293090; Device Package: 1206 (3216 Metric); Height (Max): 1.20mm; LastUpdated: 2022-07-15 12:08:20 PM; Lifecycle Status: Active; Minimum Order: 1; Mounting Type: Surface Mount; Package / Case: 1206 (3216 Metric); Packaging: TapeAndReel; PartId: 735; Part Status: Active; Price: 0.13; Series: Heli-R; Size / Dimension: 3.20mm L x 1.60mm W; Supplier 1: DigiKey; Supplier Part Number 1: 754-APTL3216QBC/D-01CT-ND; Supplier Device Package: 1206; Value: Blue
P1 P2 = Header 24: Header, 24-Pin; LatestRevisionDate: 17-Jul-2002; LatestRevisionNote: Re-released for DXP Platform.; Publisher: Altium Limited
P9 = Header 8: Header, 8-Pin; LatestRevisionDate: 17-Jul-2002; LatestRevisionNote: Re-released for DXP Platform.; Publisher: Altium Limited
R5 = JR1206X40E: 1206 40 AMP JUMPER; Manufacturer: Ohmite; Power (Watts): 0.32W; Part Number: JR1206X40E; ComponentLink1Description: Datasheet; ComponentLink1URL: https://www.ohmite.com/assets/docs/res_jr.pdf?r=false; ComponentLink2Description: DigiKey Link; ComponentLink2URL: https://www.digikey.com/en/products/detail/ohmite/JR1206X40E/10233373; Composition: Metal Element; Device Package: 1206 (3216 Metric); Height - Seated (Max): 0.028" (0.70mm); LastUpdated: 2022-07-25 2:10:41 AM; Lifecycle Status: Active; Minimum Order: 1; Number of Terminations: 2; Operating Temperature: -55°C ~ 150°C; Package / Case: 1206 (3216 Metric); Packaging: TapeAndReel; PartId: 30374; Part Status: Active; Price: 0.11; Resistance: 0 Ohms; Series: JR; Size / Dimension: 0.126" L x 0.063" W (3.20mm x 1.60mm); Supplier 1: DigiKey; Supplier Part Number 1: JR1206X40ECT-ND; Supplier Device Package: 1206; Tolerance: Jumper; Value: 0 Ohms
R6 R13 = CRGP0402F220R: RES 220 OHM 1% 1/8W 0402; Manufacturer: TE Connectivity Passive Product; Power (Watts): 0.125W, 1/8W; Temperature Coefficient: ±100ppm/°C; Part Number: CRGP0402F220R; Value: 220 Ohms; ComponentLink1Description: Datasheet; ComponentLink1URL: https://www.te.com/commerce/DocumentDelivery/DDEController?Action=srchrtrv&DocNm=9-1773463-9&DocType=DS&DocLang=English; ComponentLink2Description: DigiKey Link; ComponentLink2URL: https://www.digikey.com/en/products/detail/te-connectivity-passive-product/CRGP0402F220R/8576949; Composition: Thick Film; Device Package: 0402 (1005 Metric); Features: Pulse Withstanding; Height - Seated (Max): 0.016" (0.40mm); LastUpdated: 2022-07-15 11:43:01 AM; Lifecycle Status: Active; Minimum Order: 1; Number of Terminations: 2; Operating Temperature: -55°C ~ 155°C; Package / Case: 0402 (1005 Metric); Packaging: TapeAndReel; PartId: 6226; Part Status: Active; Price: 0.01; Resistance: 220 Ohms; Series: CRGP; Size / Dimension: 0.043" L x 0.020" W (1.10mm x 0.50mm); Supplier 1: DigiKey; Supplier Part Number 1: A130347CT-ND; Supplier Device Package: 0402; Tolerance: ±1%
TP27-TP44 = TP1
TP45-TP48 = CMP-1672-00008-1: as TP1 on sheet TOP; ComponentLink1Description: Manufacturer URL; Package Quantity: 1000; DatasheetVersion: 03/2014; Packaging: Tape and Reel; ComponentLink2URL: http://www.keyelco.com/product-pdf.cfm?p=1357; ComponentLink1URL: http://www.keyelco.com/; Mount: Surface Mount; Contact Plating: Silver; PackageDescription: 1-Pin Surface Mount Device, Body 3.81 x 2.03 mm; Pins: 1; RoHSCompliant: True; Mounting Technology: Surface Mount; ComponentLink2Description: Datasheet; PackageReference: 5019

## Sheet CONNECTORS.SchDoc
size A4; SheetNumber: 2; SheetTotal: 8
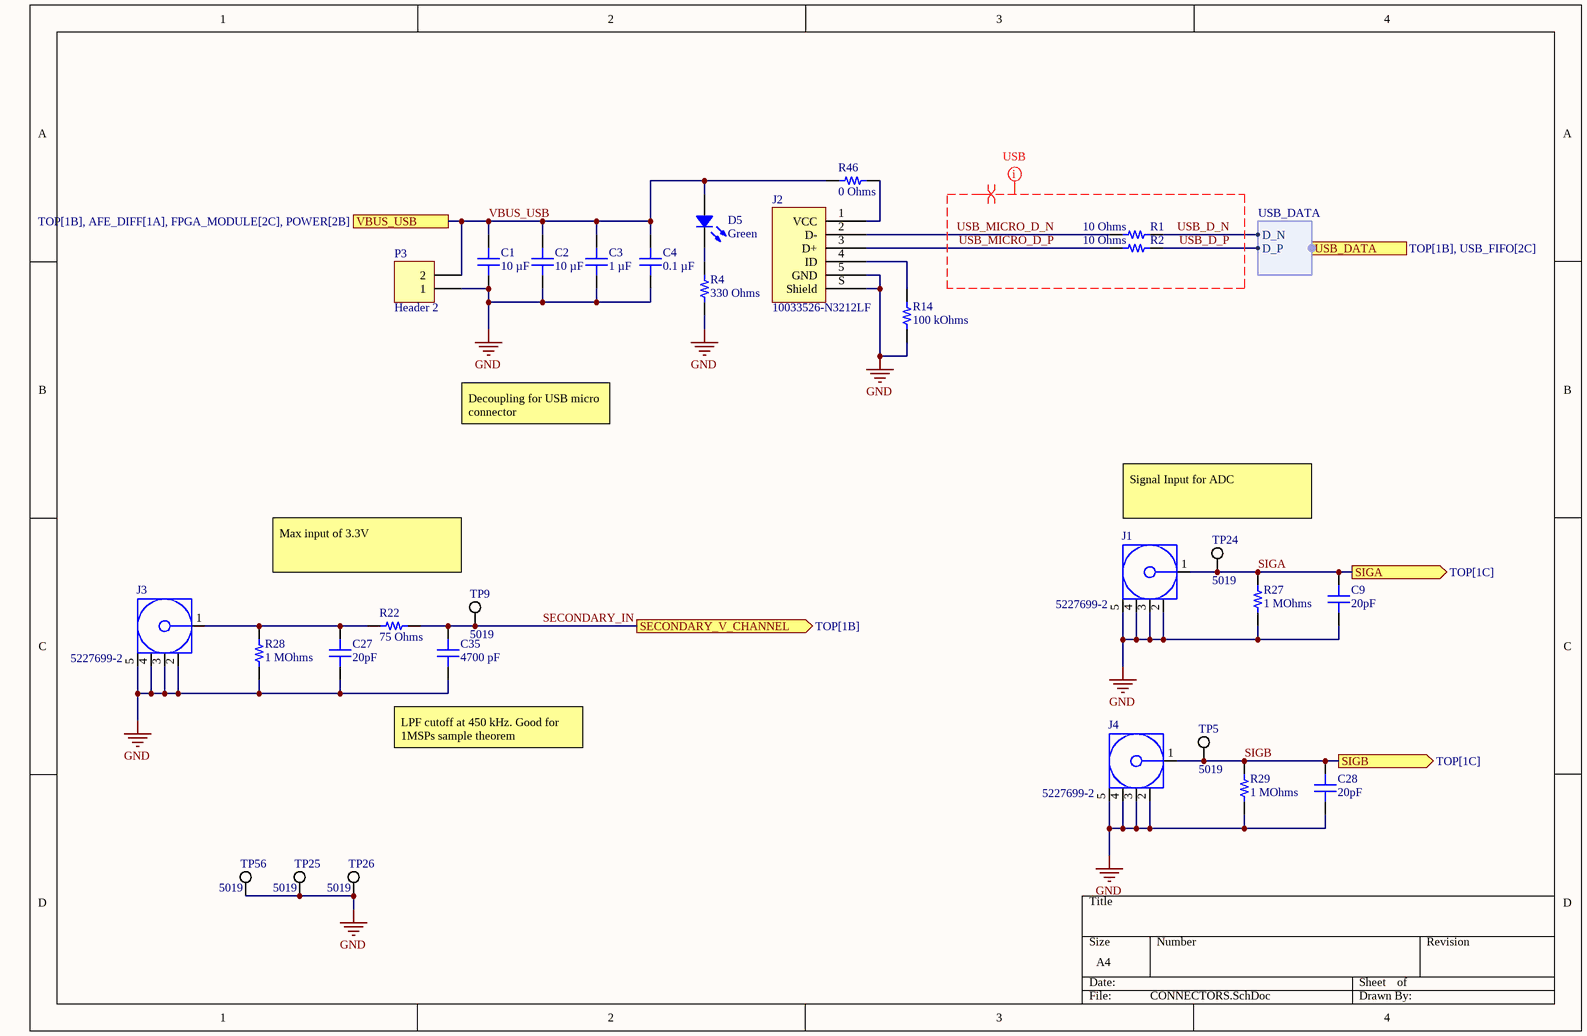
[diagram p3: CONNECTORS.SchDoc]

### Parts
C1  10 µF  [CAP 0402_1005]
C2  10 µF  [CAP 0402_1005]
C3  1 µF  [CAP 0402_1005]
C4  0.1 µF  [CAP 0402_1005]
C9  20pF  [CAP 0402_1005]
C27  20pF  [CAP 0402_1005]
C28  20pF  [CAP 0402_1005]
C35  4700 pF  [CAP 0603_1608]
D5  Green  [LED 1206_3216 GREEN]
J1  5227699-2  [TECO-5227699-2_V]
J2  10033526-N3212LF  [FCI USB 10033526-N3212LF]
J3  5227699-2  [TECO-5227699-2_V]
J4  5227699-2  [TECO-5227699-2_V]
P3  Header 2  [HDR1X2]
R1  10 Ohms  [RES 0603_1608]
R2  10 Ohms  [RES 0603_1608]
R4  330 Ohms  [RES 0402_1005]
R14  100 kOhms  [RES 0402_1005]
R22  75 Ohms  [RES 0603_1608]
R27  1 MOhms  [RES 0402_1005]
R28  1 MOhms  [RES 0402_1005]
R29  1 MOhms  [RES 0402_1005]
R46  0 Ohms  [RES 0603_1608]
TP5  5019  [KSTN-5019_V]
TP9  5019  [KSTN-5019_V]
TP24  5019  [KSTN-5019_V]
TP25  5019  [KSTN-5019_V]
TP26  5019  [KSTN-5019_V]
TP56  5019  [KSTN-5019_V]

### Ports
SECONDARY_V_CHANNEL (out, see TOP[1B]), SIGA (out, see TOP[1C]), SIGB (out, see TOP[1C]), USB_DATA (harness USB_DATA, see TOP[1B], USB_FIFO[2C]), VBUS_USB (see TOP[1B], AFE_DIFF[1A], FPGA_MODULE[2C], POWER[2B])

### Harnesses
USB_DATA: D_N, D_P

### Nets
GND: C1.1 C2.1 C3.1 C4.1 C9.1 C27.1 C28.1 C35.1 J1.2 J1.3 J1.4 J1.5 J2.5(GND) J2.S(Shield) J3.2 J3.3 J3.4 J3.5 J4.2 J4.3 J4.4 J4.5 P3.1 R4.1 R14.1 R27.1 R28.1 R29.1 TP25.1 TP26.1 TP56.1
SECONDARY_IN: C35.2 R22.2 TP9.1 ; port SECONDARY_V_CHANNEL  [project net FPGA_ADC1]
SIGA: C9.2 J1.1 R27.2 TP24.1 ; port SIGA
SIGB: C28.2 J4.1 R29.2 TP5.1 ; port SIGB
USB_D_N: R1.2 ; port USB_DATA.D_N
USB_D_P: R2.2 ; port USB_DATA.D_P
USB_MICRO_D_N: J2.2(D-) R1.1
USB_MICRO_D_P: J2.3(D+) R2.1
VBUS_USB: C1.2 C2.2 C3.2 C4.2 D5.1 P3.2 R46.2 ; port VBUS_USB
NetC27_2: C27.2 J3.1 R22.1 R28.2
NetD5_2: D5.2 R4.2
NetJ2_1: J2.1(VCC) R46.1
NetJ2_4: J2.4(ID) R14.2

### Layout directives
differential pair; net class DIFF90: USB_D_N, USB_D_P, USB_MICRO_D_N, USB_MICRO_D_P
net class USB: USB_D_N, USB_D_P, USB_MICRO_D_N, USB_MICRO_D_P

### Notes on the sheet
- Decoupling for USB micro connector
- Signal Input for ADC
- Max input of 3.3V
- (near C35) LPF cutoff at 450 kHz. Good for 1MSPs sample theorem

### Library data of the parts
C1 C2 = CL05A106MP8NUB8: CAP CER 10UF 10V X5R 0402; manufacturer: Samsung Electro-Mechanics; Tolerance: ±20%; Part Number: CL05A106MP8NUB8; Value: 10 µF; Applications: General Purpose; Capacitance: 10 µF; componentlink1description: Datasheet; componentlink1url: http://www.samsungsem.com/kr/support/product-search/mlcc/CL05A106MP8NUB8.jsp; componentlink2description: DigiKey Link; componentlink2url: https://www.digikey.com/en/products/detail/samsung-electro-mechanics/CL05A106MP8NUB8/5961314; Device Package: 0402 (1005 Metric); lastupdated: 2022-07-15 11:25:56 AM; Lifecycle Status: Active; Minimum Order: 1; Mounting Type: Surface Mount, MLCC; Operating Temperature: -55°C ~ 85°C; Package / Case: 0402 (1005 Metric); packaging: TapeAndReel; partid: 1758; Part Status: Active; price: 0.07; series: CL; Size / Dimension: 0.039" L x 0.020" W (1.00mm x 0.50mm); Supplier 1: DigiKey; Supplier Part Number 1: 1276-6830-1-ND; Temperature Coefficient: X5R; Thickness (Max): 0.035" (0.90mm); Voltage - Rated: 10V
C3 = GRM155C71A105KE11D: CAP CER 1UF 10V X7S 0402; manufacturer: Murata Electronics; Tolerance: ±10%; Part Number: GRM155C71A105KE11D; Value: 1 µF; Applications: General Purpose; Capacitance: 1 µF; componentlink1description: Datasheet; componentlink1url: https://search.murata.co.jp/Ceramy/image/img/A01X/G101/ENG/GRM155C71A105KE11-01.pdf; componentlink2description: DigiKey Link; componentlink2url: https://www.digikey.com/en/products/detail/murata-electronics/GRM155C71A105KE11D/6606086; Device Package: 0402 (1005 Metric); lastupdated: 2022-07-15 11:25:56 AM; Lifecycle Status: Active; Minimum Order: 1; Mounting Type: Surface Mount, MLCC; Operating Temperature: -55°C ~ 125°C; Package / Case: 0402 (1005 Metric); packaging: TapeAndReel; partid: 1749; Part Status: Active; price: 0.01; series: GRM; Size / Dimension: 0.039" L x 0.020" W (1.00mm x 0.50mm); Supplier 1: DigiKey; Supplier Part Number 1: 490-14457-1-ND; Temperature Coefficient: X7S; Thickness (Max): 0.024" (0.60mm); Voltage - Rated: 10V
C4 = CGA2B3X5R1H104M050BB: as C11 on sheet USB_FIFO; Part Number: CGA2B3X5R1H104M050BB; Value: 0.1 µF; Applications: Automotive; Capacitance: 0.1 µF; componentlink1description: Datasheet; componentlink1url: https://product.tdk.com/info/en/catalog/datasheets/mlcc_automotive_general_en.pdf?ref_disty=digikey; componentlink2description: DigiKey Link; componentlink2url: https://www.digikey.com/en/products/detail/tdk-corporation/CGA2B3X5R1H104M050BB/3949450; Device Package: 0402 (1005 Metric); lastupdated: 2022-07-15 11:25:55 AM; Lifecycle Status: Active; Minimum Order: 1; Mounting Type: Surface Mount, MLCC; Operating Temperature: -55°C ~ 85°C; Package / Case: 0402 (1005 Metric); packaging: TapeAndReel; partid: 1792; Part Status: Active; price: 0.02; Ratings: AEC-Q200; series: CGA; Size / Dimension: 0.039" L x 0.020" W (1.00mm x 0.50mm); Supplier 1: DigiKey; Supplier Part Number 1: 445-12214-1-ND; Temperature Coefficient: X5R; Thickness (Max): 0.022" (0.55mm); Voltage - Rated: 50V
C9 C27 C28 = 04023U200JAT2A: CAP CER 20PF 25V NP0 0402; manufacturer: AVX Corporation; Temperature Coefficient: C0G, NP0; Tolerance: ±5%; Part Number: 04023U200JAT2A; Value: 20pF; Applications: RF, Microwave, High Frequency; Capacitance: 20pF; componentlink1description: Datasheet; componentlink1url: http://datasheets.avx.com/U-Series.pdf; componentlink2description: DigiKey Link; componentlink2url: http://digikey.com/product-detail/en/avx-corporation/04023U200JAT2A/478-11758-1-ND/8573394; Device Package: 0402 (1005 Metric); Features: Ultra Low ESR; lastupdated: 2022-02-08 12:26:58 PM; Lifecycle Status: Active; Minimum Order: 1; Mounting Type: Surface Mount, MLCC; Operating Temperature: -55°C ~ 125°C; Package / Case: 0402 (1005 Metric); packaging: TapeAndReel; partid: 1805; Part Status: Active; price: 0.02; series: U; Size / Dimension: 0.039" L x 0.020" W (1.00mm x 0.50mm); Supplier 1: DigiKey; Supplier Part Number 1: 478-11758-1-ND; Thickness (Max): 0.022" (0.55mm); Voltage - Rated: 25V
C35 = C0603C472K4RECAUTO: CAP CER 0603 4.7NF 16V X7R 10%; manufacturer: KEMET; Part Number: C0603C472K4RECAUTO; Value: 4700 pF; Applications: Automotive, ESD Protection; Capacitance: 4700 pF; componentlink1description: Datasheet; componentlink1url: https://api.kemet.com/component-edge/download/datasheet/C0603C472K4RECAUTO.pdf; componentlink2description: DigiKey Link; componentlink2url: https://www.digikey.com/en/products/detail/kemet/C0603C472K4RECAUTO/8640473; Device Package: 0603 (1608 Metric); lastupdated: 2022-09-18 12:10:47 PM; Lifecycle Status: Active; Minimum Order: 1; Mounting Type: Surface Mount, MLCC; Operating Temperature: -55°C ~ 125°C; Package / Case: 0603 (1608 Metric); packaging: TapeAndReel; partid: 17340; Part Status: Active; price: 0.02; Ratings: AEC-Q200; series: ESD SMD Auto X7R; Size / Dimension: 0.063" L x 0.031" W (1.60mm x 0.80mm); Supplier 1: DigiKey; Supplier Part Number 1: 399-17879-1-ND; Temperature Coefficient: X7R; Thickness (Max): 0.034" (0.87mm); Tolerance: ±10%; Voltage - Rated: 16V
D5 = APTL3216ZGCK-01: LED SMD; Manufacturer: Kingbright; Configuration: 1206; Current - Test: 20mA; Lens Color: Colorless; Lens Size: 1.10mm Dia; Lens Style: Round with Domed Top; Lens Transparency: Clear; Millicandela Rating: 1000mcd; Viewing Angle: 80°; Voltage - Forward (Vf) (Typ): 3.3V; Wavelength - Dominant: 525nm; Wavelength - Peak: 515nm; Part Number: APTL3216ZGCK-01; Color: Green; ComponentLink1Description: Datasheet; ComponentLink1URL: http://www.kingbrightusa.com/images/catalog/SPEC/APTL3216ZGCK-01.pdf; ComponentLink2Description: DigiKey Link; ComponentLink2URL: https://www.digikey.com/en/products/detail/kingbright/APTL3216ZGCK-01/10293089; Device Package: 1206 (3216 Metric); Height (Max): 1.20mm; LastUpdated: 2022-07-15 12:08:33 PM; Lifecycle Status: Active; Minimum Order: 1; Mounting Type: Surface Mount; Package / Case: 1206 (3216 Metric); Packaging: TapeAndReel; PartId: 546; Part Status: Active; Price: 0.18; Series: Heli-R; Size / Dimension: 3.20mm L x 1.60mm W; Supplier 1: DigiKey; Supplier Part Number 1: 754-APTL3216ZGCK-01CT-ND; Supplier Device Package: 1206; Value: Green
J1 J3 J4 = CMP-2000-05627-1: Jack BNC Connector, 1 Position, Height 16.26 mm, Tail Length 6.35 mm, -55 to 85 degC, RoHS, Tube; Manufacturer: TE Connectivity; Frequency - Max: 4GHz; Dynamic Catalog: BNCConnectors; Connector Type: Jack,FemaleSockets; Other Names: A32269; Impedance: 50Ohm; 3D Model: 5227699-2.pdf; Contact Termination: Solder; Standard Package: 30; Mounting Technology: ThroughHole; Package Reference: 5227699-2; Category: Connectors,Interconnects; Datasheet URL: http://www.te.com/commerce/DocumentDelivery/DDEController?Action=showdoc&DocId=Customer+Drawing%7F5227699%7FA1%7Fpdf%7FEnglish%7FENG_CD_5227699_A1.pdf%7F5227699-2; Mounting Type: ThroughHole,Flange(Square); Datasheet Version: Rev. A1, 03/2011; Manufacturer URL: http://www.te.com/; RoHS Information: 5227699-2StatementofCompliance; Fastening Type: BayonetLock; Series: BNC; Connector Style: BNC; Family: CoaxialConnectors(RF); Packaging: Bulk; Package Description: Jack BNC Connector, 1 Position, Height 16.26 mm, Tail Length 6.35 mm
J2 = 10033526-N3212LF: CONN RCPT MINI USB B 5POS SMD RA; Manufacturer: Amphenol ICC (FCI); Connector Type: USB - mini B; Current Rating (Amps): 1A per Contact; Gender: Receptacle; Mating Cycles: 5000; Number of Contacts: 5; Number of Ports: 1; Shielding: Shielded; Voltage - Rated: 30V; Part Number: 10033526-N3212LF; ComponentLink1Description: Datasheet; ComponentLink1URL: http://www.amphenol-icc.com/media/wysiwyg/files/drawing/10033526.pdf; ComponentLink2Description: DigiKey Link; ComponentLink2URL: //digikey.com/product-detail/en/amphenol-icc-fci/10033526-N3212LF/609-4700-2-ND/4292074; Features: Board Guide, Solder Retention; LastUpdated: 2019-12-09 8:52:14 PM; Lifecycle Status: 0; Minimum Order: 1; Mounting Feature: Horizontal; Mounting Type: Surface Mount, Right Angle; Operating Temperature: -25°C ~ 85°C; Packaging: TapeAndReel; Part Status: Active; Price: 0.39; Series: -; Supplier 1: DigiKey; Supplier Part Number 1: 609-4700-2-ND; Termination: Solder
P3 = Header 2: Header, 2-Pin; LatestRevisionDate: 17-Jul-2002; LatestRevisionNote: Re-released for DXP Platform.; Publisher: Altium Limited
R1 R2 = CRT0603-BY-10R0ELF: RES SMD 10 OHM 0.1% 1/10W 0603; Manufacturer: Bourns Inc.; Power (Watts): 0.1W, 1/10W; Temperature Coefficient: ±25ppm/°C; Part Number: CRT0603-BY-10R0ELF; Value: 10 Ohms; ComponentLink1Description: Datasheet; ComponentLink1URL: https://www.bourns.com/docs/Product-Datasheets/crt.pdf; ComponentLink2Description: DigiKey Link; ComponentLink2URL: https://www.digikey.com/en/products/detail/bourns-inc/CRT0603-BY-10R0ELF/1775018; Composition: Thin Film; Device Package: 0603 (1608 Metric); Features: Current Sense; Height - Seated (Max): 0.024" (0.60mm); LastUpdated: 2022-07-15 11:50:25 AM; Lifecycle Status: Active; Minimum Order: 1; Number of Terminations: 2; Operating Temperature: -55°C ~ 155°C; Package / Case: 0603 (1608 Metric); Packaging: TapeAndReel; PartId: 4866; Part Status: Active; Price: 0.04; Resistance: 10 Ohms; Series: CRT; Size / Dimension: 0.061" L x 0.031" W (1.55mm x 0.80mm); Supplier 1: DigiKey; Supplier Part Number 1: CRT0603-BY-10R0ELFCT-ND; Supplier Device Package: 0603; Tolerance: ±0.1%
R4 = AC0402JR-07330RL: RES SMD 330 OHM 5% 1/16W 0402; Manufacturer: Yageo; Power (Watts): 0.063W, 1/16W; Temperature Coefficient: ±100ppm/°C; Part Number: AC0402JR-07330RL; Value: 330 Ohms; ComponentLink1Description: Datasheet; ComponentLink1URL: https://www.yageo.com/upload/media/product/productsearch/datasheet/rchip/PYu-AC_51_RoHS_L_7.pdf; ComponentLink2Description: DigiKey Link; ComponentLink2URL: https://www.digikey.com/en/products/detail/yageo/AC0402JR-07330RL/5895651; Composition: Thick Film; Device Package: 0402 (1005 Metric); Features: Automotive AEC-Q200, Moisture Resistant; Height - Seated (Max): 0.015" (0.37mm); LastUpdated: 2022-07-15 11:43:11 AM; Lifecycle Status: Active; Minimum Order: 1; Number of Terminations: 2; Operating Temperature: -55°C ~ 155°C; Package / Case: 0402 (1005 Metric); Packaging: CutTape; PartId: 3389; Part Status: Active; Price: 0.01; Ratings: AEC-Q200; Resistance: 330 Ohms; Series: AC; Size / Dimension: 0.039" L x 0.020" W (1.00mm x 0.50mm); Supplier 1: DigiKey; Supplier Part Number 1: YAG3542CT-ND; Supplier Device Package: 0402; Tolerance: ±5%
R14 = CPF0402B100KE: RES SMD 100K OHM 0.1% 1/16W 0402; Manufacturer: TE Connectivity Passive Product; Power (Watts): 0.063W, 1/16W; Temperature Coefficient: ±25ppm/°C; Part Number: CPF0402B100KE; Value: 100 kOhms; ComponentLink1Description: Datasheet; ComponentLink1URL: https://www.te.com/commerce/DocumentDelivery/DDEController?Action=srchrtrv&DocNm=1773200&DocType=DS&DocLang=English; ComponentLink2Description: DigiKey Link; ComponentLink2URL: https://www.digikey.com/en/products/detail/te-connectivity-passive-product/CPF0402B100KE/4966480; Composition: Thin Film; Device Package: 0402 (1005 Metric); Height - Seated (Max): 0.014" (0.35mm); LastUpdated: 2022-09-19 1:15:04 PM; Lifecycle Status: Active; Minimum Order: 1; Number of Terminations: 2; Operating Temperature: -55°C ~ 155°C; Package / Case: 0402 (1005 Metric); Packaging: TapeAndReel; PartId: 2472; Part Status: Active; Price: 0.10; Resistance: 100 kOhms; Series: CPF, Neohm; Size / Dimension: 0.039" L x 0.020" W (1.00mm x 0.50mm); Supplier 1: DigiKey; Supplier Part Number 1: A119916CT-ND; Supplier Device Package: 0402; Tolerance: ±0.1%
R22 = AC0603FR-0775RL: RES SMD 75 OHM 1% 1/10W 0603; Manufacturer: Yageo; Power (Watts): 0.1W, 1/10W; Temperature Coefficient: ±100ppm/°C; Part Number: AC0603FR-0775RL; Value: 75 Ohms; ComponentLink1Description: Datasheet; ComponentLink1URL: https://www.yageo.com/upload/media/product/productsearch/datasheet/rchip/PYu-AC_51_RoHS_L_7.pdf; ComponentLink2Description: DigiKey Link; ComponentLink2URL: https://www.digikey.com/en/products/detail/yageo/AC0603FR-0775RL/5896285; Composition: Thick Film; Device Package: 0603 (1608 Metric); Features: Automotive AEC-Q200, Moisture Resistant; Height - Seated (Max): 0.022" (0.55mm); LastUpdated: 2022-09-18 12:28:42 PM; Lifecycle Status: Active; Minimum Order: 1; Number of Terminations: 2; Operating Temperature: -55°C ~ 155°C; Package / Case: 0603 (1608 Metric); Packaging: CutTape; PartId: 15287; Part Status: Active; Price: 0.01; Ratings: AEC-Q200; Resistance: 75 Ohms; Series: AC; Size / Dimension: 0.063" L x 0.031" W (1.60mm x 0.80mm); Supplier 1: DigiKey; Supplier Part Number 1: YAG3630CT-ND; Supplier Device Package: 0603; Tolerance: ±1%
R27-R29 = RMCF0402FT1M00: RES 1M OHM 1% 1/16W 0402; Manufacturer: Stackpole Electronics Inc; Power (Watts): 0.063W, 1/16W; Temperature Coefficient: ±100ppm/°C; Part Number: RMCF0402FT1M00; Value: 1 MOhms; ComponentLink1Description: Datasheet; ComponentLink1URL: https://www.seielect.com/catalog/sei-rmcf_rmcp.pdf; ComponentLink2Description: DigiKey Link; ComponentLink2URL: https://www.digikey.com/en/products/detail/stackpole-electronics-inc/RMCF0402FT1M00/1761748; Composition: Thick Film; Device Package: 0402 (1005 Metric); Features: Automotive AEC-Q200; Height - Seated (Max): 0.016" (0.40mm); LastUpdated: 2022-09-19 1:14:56 PM; Lifecycle Status: Active; Minimum Order: 1; Number of Terminations: 2; Operating Temperature: -55°C ~ 155°C; Package / Case: 0402 (1005 Metric); Packaging: CutTape; PartId: 4912; Part Status: Active; Price: 0.01; Ratings: AEC-Q200; Resistance: 1 MOhms; Series: RMCF; Size / Dimension: 0.039" L x 0.020" W (1.00mm x 0.50mm); Supplier 1: DigiKey; Supplier Part Number 1: RMCF0402FT1M00CT-ND; Supplier Device Package: 0402; Tolerance: ±1%
R46 = 5110: as R15 on sheet USB_FIFO; Value: 0 Ohms; ComponentLink1Description: Datasheet; ComponentLink1URL: http://keyelco.com/userAssets/file/M65p54.pdf; ComponentLink2Description: DigiKey Link; ComponentLink2URL: https://www.digikey.com/en/products/detail/keystone-electronics/5110/5118870; Composition: Metal Element; Device Package: 0603 (1608 Metric); Height - Seated (Max): 0.028" (0.70mm); LastUpdated: 2022-09-14 8:08:57 AM; Lifecycle Status: Active; Minimum Order: 1; Number of Terminations: 2; Package / Case: 0603 (1608 Metric); Packaging: TapeAndReel; PartId: 20779; Part Status: Active; Price: 0.16; Resistance: 0 Ohms; Series: -; Size / Dimension: 0.061" L x 0.033" W (1.55mm x 0.85mm); Supplier 1: DigiKey; Supplier Part Number 1: 36-5110CT-ND; Supplier Device Package: 0603; Tolerance: Jumper
TP5 TP9 TP24-TP26 TP56 = CMP-1672-00008-1: as TP1 on sheet TOP; ComponentLink1Description: Manufacturer URL; Package Quantity: 1000; DatasheetVersion: 03/2014; Packaging: Tape and Reel; ComponentLink2URL: http://www.keyelco.com/product-pdf.cfm?p=1357; ComponentLink1URL: http://www.keyelco.com/; Mount: Surface Mount; Contact Plating: Silver; PackageDescription: 1-Pin Surface Mount Device, Body 3.81 x 2.03 mm; Pins: 1; RoHSCompliant: True; Mounting Technology: Surface Mount; ComponentLink2Description: Datasheet; PackageReference: 5019